# EAGLE design Module2 (EAGLE 7.5.0)
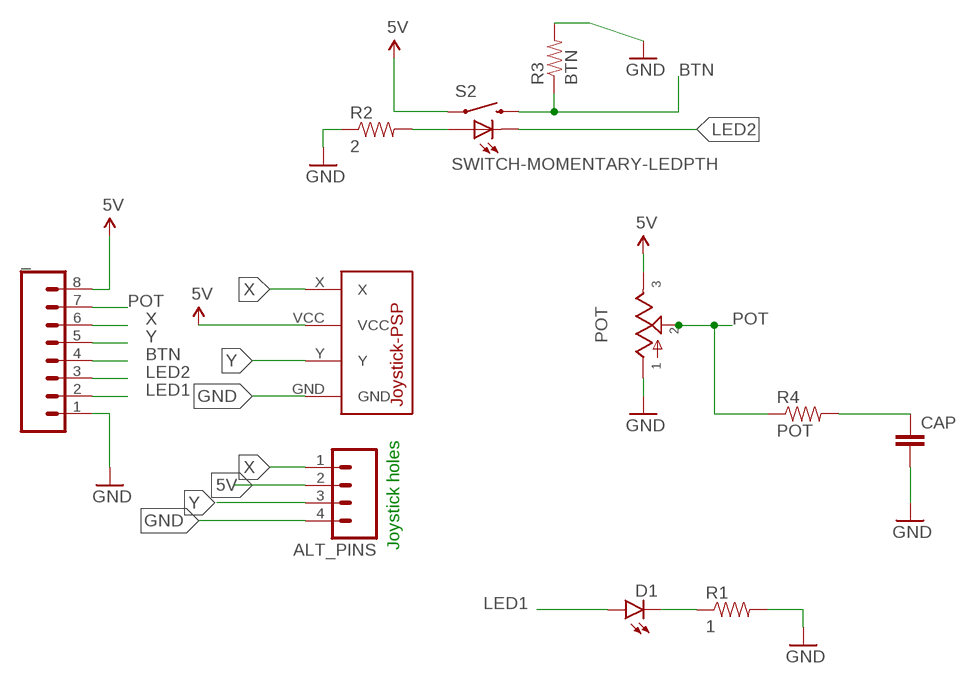
[diagram p0: schematic, sheet 1]

## Parts
_  M08  [1X08_ROUND]
ALT_PINS  M04NO_SILK_ALL_ROUND  [1X04_NO_SILK_ALL_ROUND]
CAP  CAPEZ  [CAP-PTH-SMALLEZ]
D1  LED3MM  [LED3MM]
POT  POT  [POT]
R1  1  10KOHM-1/6W-5%(PTH)KIT  [AXIAL-0.3-KIT]
R2  2  10KOHM-1/6W-5%(PTH)KIT  [AXIAL-0.3-KIT]
R3  BTN  10KOHM-1/6W-5%(PTH)KIT  [AXIAL-0.3-KIT]
R4  POT  10KOHM-1/6W-5%(PTH)KIT  [AXIAL-0.3-KIT]
S2  SWITCH-MOMENTARY-LEDPTH  [TACTILE-PTH-LED-12MM]
U$1  JOYSTICK-PSP1000  [JOYSTICK-PSP1000]

## Nets
5V: _.8 ALT_PINS.2 POT.3 S2.4 U$1.VCC
BTN: _.4 R3.P$1 S2.2
GND: _.1 ALT_PINS.4 CAP.2 POT.1 R1.P$2 R2.P$1 R3.P$2 U$1.GND
LED1: _.2 D1.A
LED2: _.3 S2.C
N$1: D1.K(C) R1.P$1
N$2: R2.P$2 S2.A
N$3: CAP.1 R4.P$2
POT: _.7 POT.2 R4.P$1
X: _.6 ALT_PINS.1 U$1.X
Y: _.5 ALT_PINS.3 U$1.Y

## Notes on the sheet
- Joystick holes

## Library data of the parts
_ = SparkFun-Connectors:M08: Header 8 Standard 8-pin 0.1" header. Use with straight break away headers (SKU : PRT-00116), right angle break away headers (PRT-00553), swiss pins (PRT-00743), machine pins (PRT-00117), and female headers (PRT-00115).; PROD_ID: CONN-08437
ALT_PINS = SparkFun-Connectors:M04: Header 4 Standard 4-pin 0.1" header. Use with straight break away headers (SKU : PRT-00116), right angle break away headers (PRT-00553), swiss pins (PRT-00743), machine pins (PRT-00117), and female headers (PRT-00115). Molex polarized connector foot print use with SKU : PRT-08231 with associated crimp pins and housings. 1MM SMD Version SKU: PRT-10208; PROD_ID: CONN-09696
CAP = SparkFun-Capacitors:CAP: Capacitor Standard 0603 ceramic capacitor, and 0.1" leaded capacitor.
D1 = SparkFun-LED:LED: LEDs Standard schematic elements and footprints for 5mm, 3mm, 1206, and 0603 sized LEDs. 5mm - Spark Fun Electronics SKU : COM-00529 (and others); PROD_ID: DIO-08794
POT = gm-pots:POT: Potentiometers the arrow indicates the clockwise motion of th wiper (lug 2) fully counter clockwise there is no resistance between lugs 1 and 2 fully clockwise the resistance between lugs 1 and 2 is the value of the pot
R1-R4 = SparkFun-Resistors:10KOHM-1/6W-5%(PTH): RES-08375; PROD_ID: RES-08375
S2 = Local Library:SWITCH-MOMENTARY-LED
U$1 = SparkFun-Electromechanical:JOYSTICK-PSP1000: This is a footprint for the PSP-1000 Joystick. 4-pins: X, Y, Vcc and GND

## Net classes
0 default: width 0.635 mm, drill 0.254 mm, clearance 0.381 mm
1 5V: width 0.635 mm, drill 0.254 mm, clearance 0.381 mm

## Board
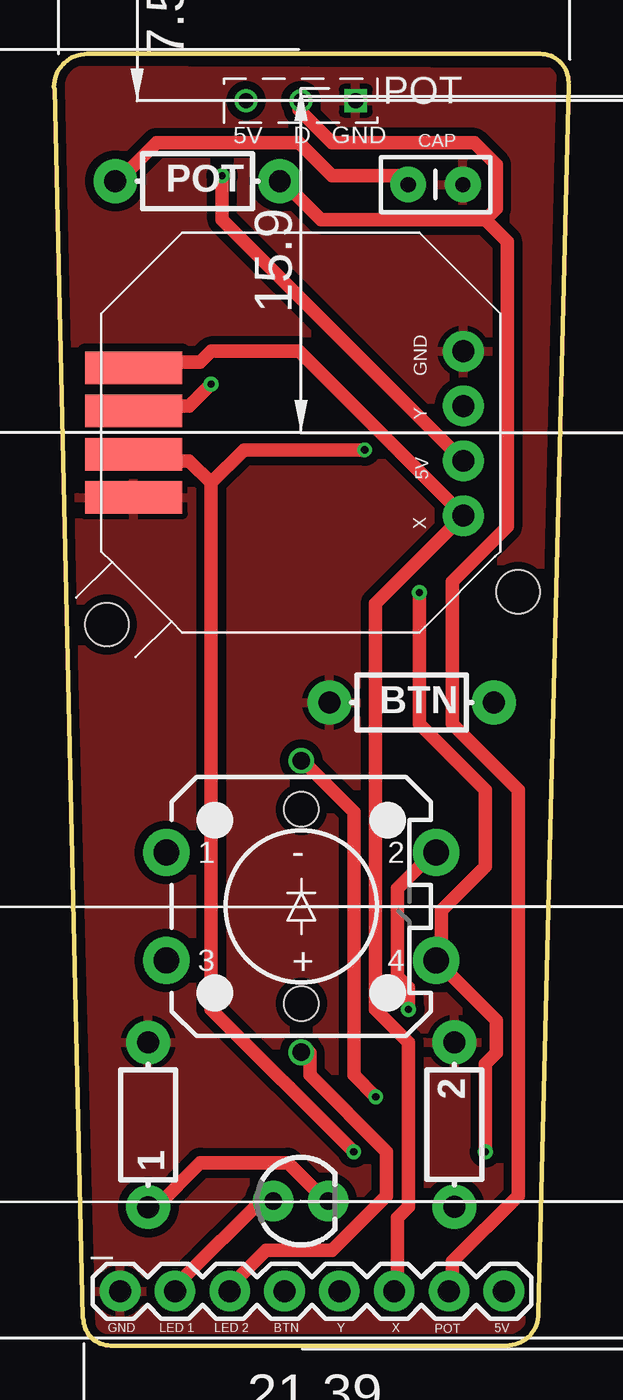
[diagram p1: board, top side]
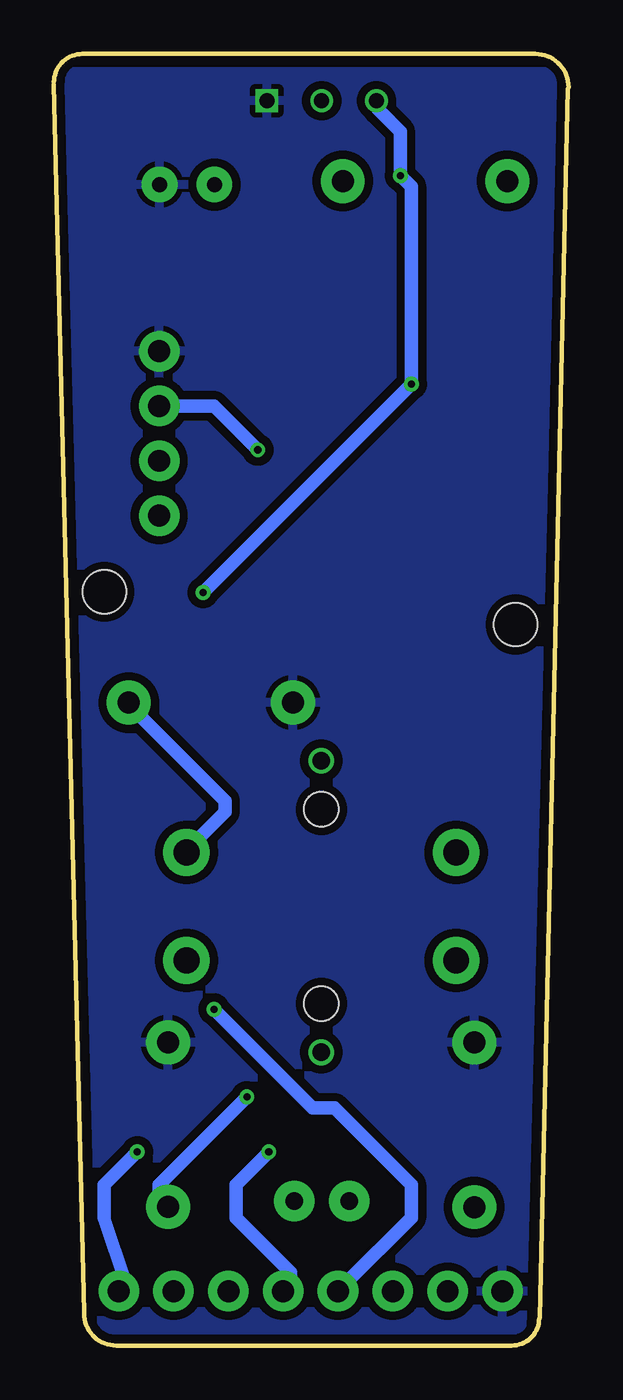
[diagram p2: board, bottom side, seen from below]

Size 23.85 x 59.82 mm. Coordinates in mm from the lower left corner, seen from the top.
Outline: 1.37,1.32 1.37,1.26 arc90 2.62,0 20.97,0 arc90 22.45,1.48
Outline: 0,58.29 arc-90 1.53,59.82 22.54,59.82 arc-90 23.85,58.51
Outline: 1.33,1.29 0.03,58.21
Outline: 23.85,58.43 22.45,1.52
Copper layers (1*16): Top 0.0356mm / dielectric 1.5011mm / Bottom 0.0356mm
Design rules "LaenPCBOrder": minimum track width 6mil, minimum drill 13mil, track to track 6mil, track to pad 6mil, pad to pad 6mil, via to via 6mil, smd to smd 6mil, copper to edge 15mil, drill to drill 6mil, minimum pad ring 7mil, minimum via ring 7mil, stop-mask expansion 3mil, vias tented up to drill 0mil, thermal gap 10mil

### Footprints (pad centres in the part's own frame; a part is rotated, then mirrored left to right if it is on the bottom)
1X08_ROUND = drill 1.016 pad 1.88: 1 0,0; 2 2.54,0; 3 5.08,0; 4 7.62,0; 5 10.16,0; 6 12.7,0; 7 15.24,0; 8 17.78,0
1X04_NO_SILK_ALL_ROUND = drill 1.016 pad 1.88: 1 0,0; 2 2.54,0; 3 5.08,0; 4 7.62,0
CAP-PTH-SMALLEZ = drill 0.7 pad 1.651: 1 0,0; 2 2.54,0
LED3MM = drill 0.813 pad 1.88: A -1.27,0; K 1.27,0
POT = drill 0.7 square: 1 2.54,0 | drill 0.7: 2 0,0; 3 -2.54,0
AXIAL-0.3-KIT = drill 1.016 pad 2.032: P$1 -3.81,0; P$2 3.81,0
TACTILE-PTH-LED-12MM = drill 1.2 pad 2.159: 1 -6.25,2.5; 2 6.25,2.5; 3 -6.25,-2.5; 4 6.25,-2.5 | drill 0.8: A 0,6.75; C 0,-6.75 | hole 1.6: 0,4.5; 0,-4.5
JOYSTICK-PSP1000 = smd 1.5 x 4.5: GND -3,7.75; VCC 1,7.75; X 3,7.75; Y -1,7.75 | hole 2: -8.89,8.985; -7.375,-10.06

### Placement (x,y rotation side)
_  3.07,2.52 0 top
ALT_PINS  18.97,38.44 90 top
CAP  16.41,53.77 0 top
D1  11.44,6.69 0 top
POT  11.44,57.65 0 top
R1  4.37,10.22 90 top
R2  18.56,10.24 270 top
R3  16.57,29.78 180 top
R4  6.66,53.94 180 top
S2  11.46,20.34 0 top
U$1  11.44,42.28 90 top

### Tracks (layer width: path | path; a pad name or v marks a point on that pad's centre or on a via)
5V  (via drill 0.33)
  Top 0.635: v19.99,8.97 19.99,13.04 20.5,13.54 20.5,15.07 17.96,17.61 S2.4 17.96,18.12 17.96,20.15 19.99,22.18 19.99,25.74 16.94,28.78 v16.94,34.88 | v7.8,54.18 7.8,52.15 ALT_PINS.2 | v7.29,44.53 6.27,43.52 3.73,43.52 U$1.VCC
  Bottom 0.61: 20.5,2.88 21.51,5.92
  Bottom 0.635: 21.51,5.92 21.51,7.45 v19.99,8.97 | 20.5,2.88 _.8 | POT.3 8.81,57.23 7.8,56.22 v7.8,54.18 7.29,53.68 v7.29,44.53 v16.94,34.88
BTN  (via drill 0.33)
  Top 0.635: v16.43,15.58 16.43,16.59 15.92,17.1 15.92,21.16 17.45,22.69 S2.2
  Bottom 0.635: v16.43,15.58 11.86,11 10.84,11 7.29,7.45 7.29,5.92 10.34,2.88 _.4 | R3.P$1 19.99,29.29 15.92,25.23 15.92,24.72 17.45,23.2 S2.2
GND
  pour Top: 0.62,59.1 23.07,59.01 21.64,0.72 2.15,0.72
  pour Bottom: 0.67,59.03 23.18,59.01 21.67,0.72 2.15,0.72
LED1
  Top 0.635: _.2 5.76,2.88 9.83,6.94 D1.A
LED2
  Top 0.635: S2.C 11.86,13.54 11.86,12.53 15.42,8.97 15.42,6.94 12.88,4.4 9.83,4.4 8.3,2.88 _.3
N$1
  Top 0.635: D1.K 12.37,6.94 10.84,8.46 6.78,8.46 4.75,6.43 R1.P$1
N$2  (via drill 0.33)
  Top 0.635: v14.91,11.51 13.89,12.53 13.89,24.72 11.86,26.75 S2.A
  Bottom 0.635: v14.91,11.51 18.97,7.45 18.97,6.43 R2.P$2
N$3
  Top 0.635: CAP.1 15.92,54.18 12.88,54.18 11.35,55.71 4.75,55.71 3.22,54.18 R4.P$2
POT
  Top 0.635: 19.99,52.15 20.5,52.66 20.5,54.69 19.48,55.71 12.88,55.71 11.35,57.23 POT.2 | 19.99,52.15 12.37,52.15 10.84,53.68 R4.P$1 | 19.99,52.15 21,51.14 21,37.93 18.46,35.39 18.46,28.78 21.51,25.74 21.51,6.94 18.46,3.89 18.46,2.88 _.7
X
  Top 0.635: _.6 15.92,2.88 15.92,5.92 16.43,6.43 16.43,14.05 14.91,15.58 14.91,34.37 ALT_PINS.1 11.35,46.06 7.29,46.06 6.78,45.55 3.73,45.55 U$1.X
Y  (via drill 0.33)
  Top 0.635: v13.89,8.97 7.29,15.58 7.29,39.96 | 7.29,39.96 6.27,40.98 3.73,40.98 U$1.Y | v14.4,41.48 8.81,41.48 7.29,39.96
  Bottom 0.635: v13.89,8.97 15.42,7.45 15.42,5.92 12.88,3.38 12.88,2.88 _.5 | ALT_PINS.3 16.43,43.52 v14.4,41.48

### Text on the board
tPlace: GND | Y | 5V | X | GND | LED 1 | LED 2 | BTN | Y | X | POT | 5V